# EAGLE schematic dashboard (EAGLE 8.0.1)
CREVISION: V3; DESIGNER: Henrik K. B. Jensen

## Sheet 1 of 3
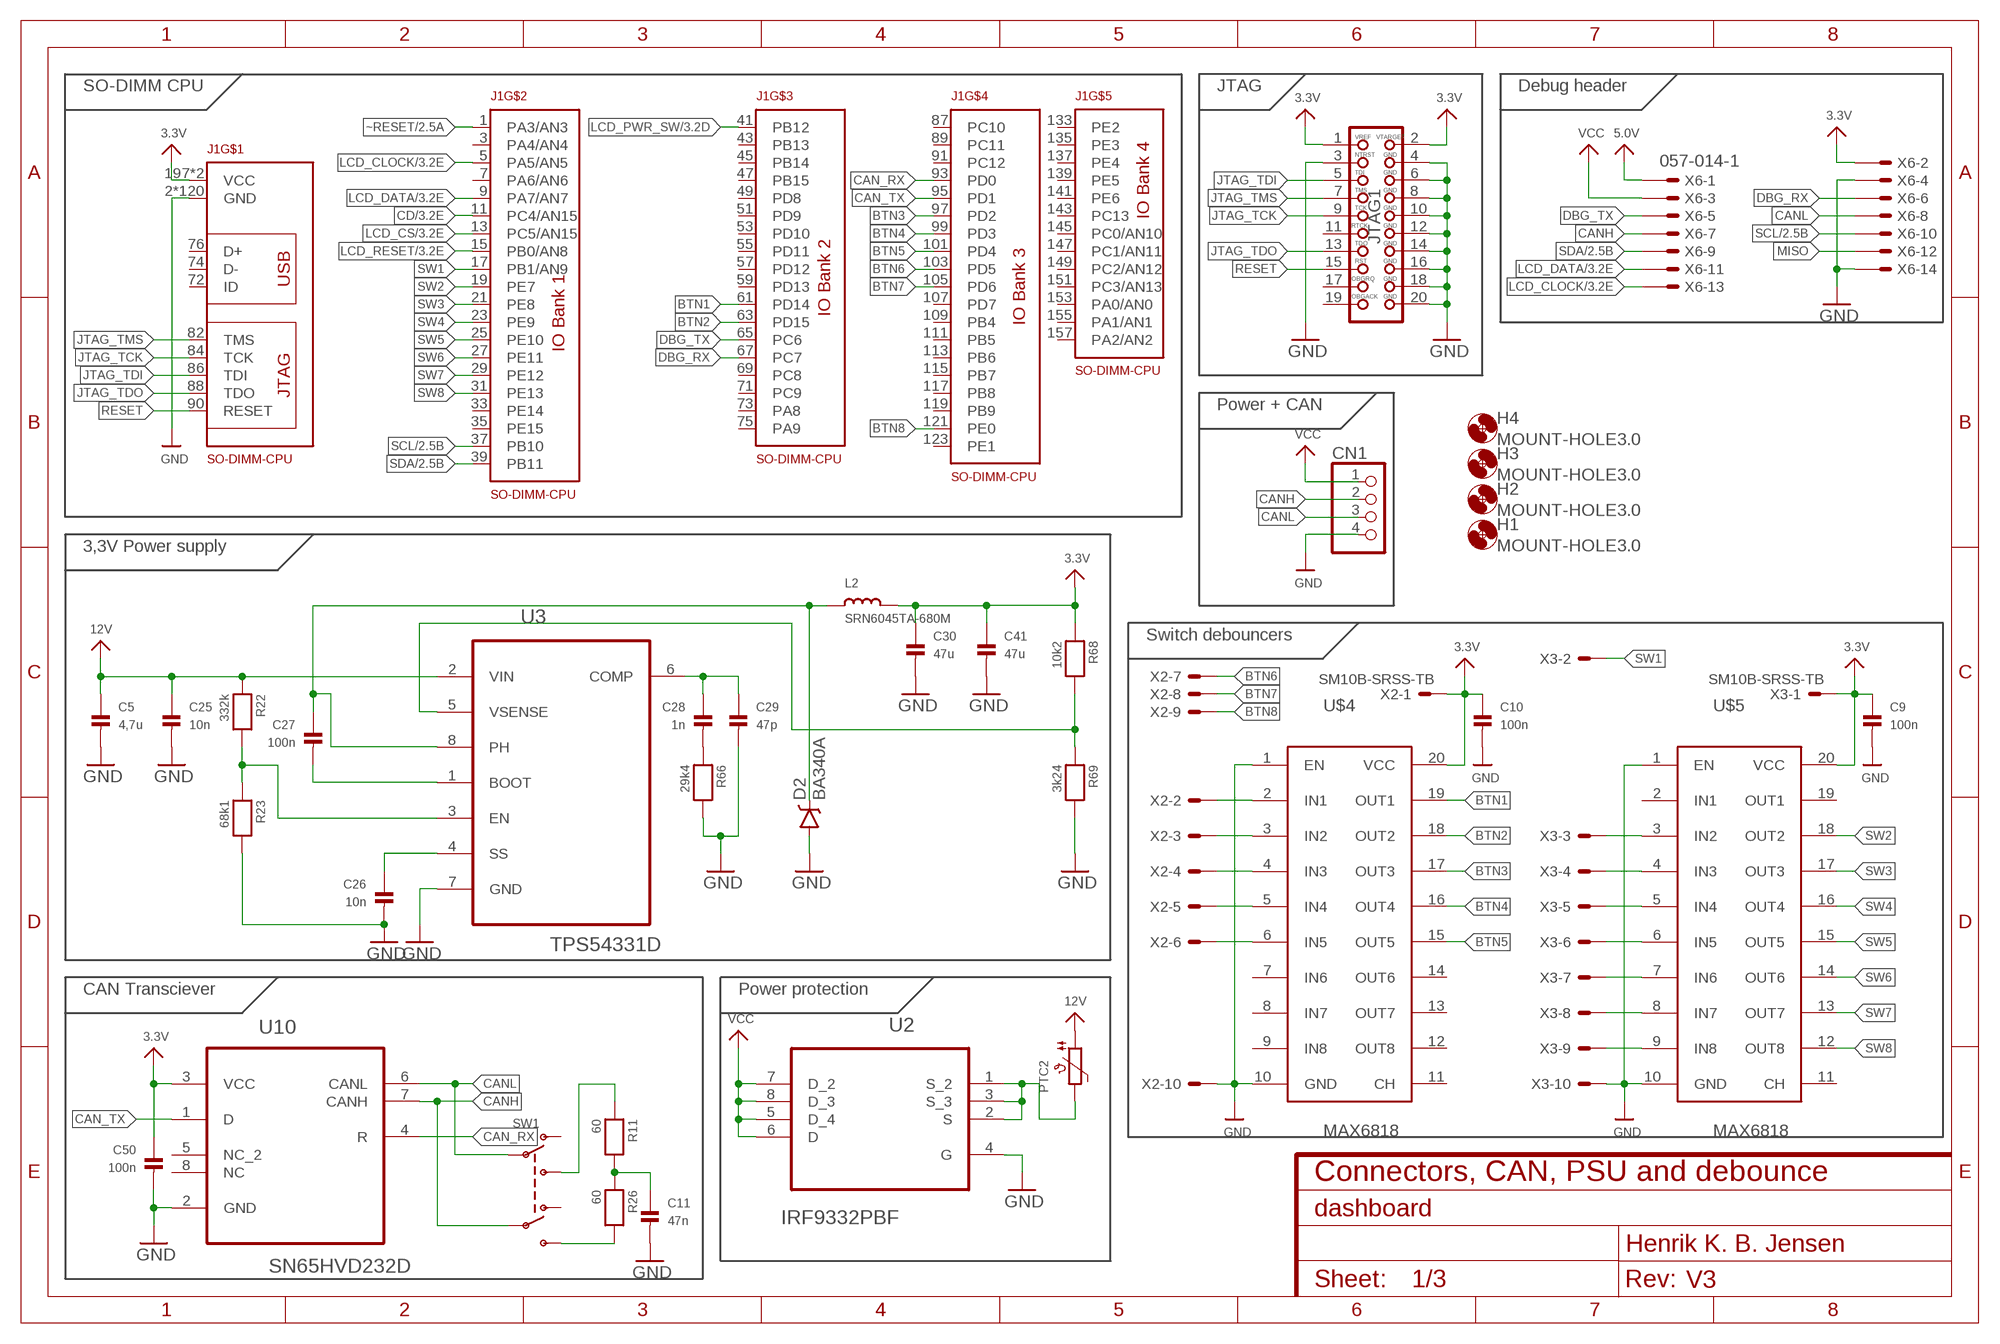
[diagram p0: schematic, sheet 1]

### Parts
C5  4,7u  CAP_CERAMIC_0805  [_0805]
C9  100n  CAP_CERAMIC_0603  [_0603]
C10  100n  CAP_CERAMIC_0603  [_0603]
C11  47n  CAP_CERAMIC_0603  [_0603]
C25  10n  CAP_CERAMIC_0603  [_0603]
C26  10n  CAP_CERAMIC_0603  [_0603]
C27  100n  CAP_CERAMIC_0603  [_0603]
C28  1n  CAP_CERAMIC_0603  [_0603]
C29  47p  CAP_CERAMIC_0603  [_0603]
C30  47u  CAP_CERAMIC_0805  [_0805]
C41  47u  CAP_CERAMIC_0805  [_0805]
C50  100n  CAP_CERAMIC_0603  [_0603]
CN1  JST_4PIN  [JSTPH4]
D2  BA340A  B340A  [SMA-DIODE]
H1  MOUNT-HOLE3.0  [3,0]
H2  MOUNT-HOLE3.0  [3,0]
H3  MOUNT-HOLE3.0  [3,0]
H4  MOUNT-HOLE3.0  [3,0]
J1  SO-DIMM-CPU  [SODIMM-CONNECTOR-2.5V]
JTAG1  JTAG-ARM  [JTAG-ARM]
L2  SRN6045TA-680M  INDUCTORTDK_VLC6045  [INDUCTOR_6X6MM_TDK_VLC6045]
PTC2  PTC1812  [PTC1812]
R11  60  RESISTOR_0603  [_0603]
R22  332k  RESISTOR_0603  [_0603]
R23  68k1  RESISTOR_0603  [_0603]
R26  60  RESISTOR_0603  [_0603]
R66  29k4  RESISTOR_0603  [_0603]
R68  10k2  RESISTOR_0603  [_0603]
R69  3k24  RESISTOR_0603  [_0603]
SW1  SWITCH_DPDT  [DPDT_SMT_JS202011SCQN]
U2  IRF9332PBF  [SOIC127P600X175-8N]
U3  TPS54331D  [SOIC127P600X175-8N]
U10  SN65HVD232D  [SOIC127P600X175-8N]
U$4  MAX6818  [SOP20]
U$5  MAX6818  [SOP20]
X2  SM10B-SRSS-TB  [SM10B-SRSS-TB]
X3  SM10B-SRSS-TB  [SM10B-SRSS-TB]
X6  057-014-1  [057-014-1]

### Nets
3.3V: C9.1 C10.1 C30.1 C41.1 C50.1 J1.197(VCC) J1.199(VCC) JTAG1.1 JTAG1.2 L2.P$2 R68.1 U10.3(VCC) U$4.20(VCC) U$5.20(VCC) X2.1 X3.1 X6.2 ; also sheet 2,3
5.0V: X6.1
12V: C5.1 C25.1 PTC2.P$1 R22.1 U3.2(VIN)
BTN1: J1.61(PD14) U$4.19(OUT1)
BTN2: J1.63(PD15) U$4.18(OUT2)
BTN3: J1.97(PD2) U$4.17(OUT3)
BTN4: J1.99(PD3) U$4.16(OUT4)
BTN5: J1.101(PD4) U$4.15(OUT5)
BTN6: J1.103(PD5) X2.7
BTN7: J1.105(PD6) X2.8
BTN8: J1.121(PE0) X2.9
CAN_RX: J1.93(PD0) U10.4(R)
CAN_TX: J1.95(PD1) U10.1(D)
CANH: CN1.2 SW1.P$5(P2) U10.7(CANH) X6.7
CANL: CN1.3 SW1.P$2(P1) U10.6(CANL) X6.8
CD: J1.11(PC4/AN15) ; also sheet 3
DBG_RX: J1.67(PC7) X6.6
DBG_TX: J1.65(PC6) X6.5
GND: C5.2 C9.2 C10.2 C11.2 C25.2 C26.2 C29.2 C30.2 C41.2 C50.2 CN1.4 D2.A J1.2(GND) J1.4(GND) J1.6(GND) J1.8(GND) J1.10(GND) J1.12(GND) J1.14(GND) J1.16(GND) J1.18(GND) J1.20(GND) J1.22(GND) J1.24(GND) J1.26(GND) J1.28(GND) J1.30(GND) J1.32(GND) J1.34(GND) J1.36(GND) J1.38(GND) J1.40(GND) J1.42(GND) J1.44(GND) J1.46(GND) J1.48(GND) J1.50(GND) J1.52(GND) J1.54(GND) J1.56(GND) J1.58(GND) J1.60(GND) J1.62(GND) J1.64(GND) J1.66(GND) J1.68(GND) J1.70(GND) J1.77(GND) J1.78(GND) J1.79(GND) J1.80(GND) J1.81(GND) J1.83(GND) J1.85(GND) J1.92(GND) J1.94(GND) J1.96(GND) J1.98(GND) J1.100(GND) J1.102(GND) J1.104(GND) J1.106(GND) J1.108(GND) J1.110(GND) J1.112(GND) J1.114(GND) J1.116(GND) J1.118(GND) J1.120(GND) J1.122(GND) J1.124(GND) J1.125(GND) J1.126(GND) J1.127(GND) J1.128(GND) J1.129(GND) J1.130(GND) J1.131(GND) J1.132(GND) J1.134(GND) J1.136(GND) J1.138(GND) J1.140(GND) J1.142(GND) J1.144(GND) J1.146(GND) J1.148(GND) J1.150(GND) J1.152(GND) J1.154(GND) J1.156(GND) J1.158(GND) J1.159(GND) J1.160(GND) J1.161(GND) J1.162(GND) J1.163(GND) J1.164(GND) J1.165(GND) J1.166(GND) J1.167(GND) J1.168(GND) J1.169(GND) J1.170(GND) J1.171(GND) J1.172(GND) J1.173(GND) J1.174(GND) J1.175(GND) J1.176(GND) J1.177(GND) J1.178(GND) J1.179(GND) J1.180(GND) J1.181(GND) J1.182(GND) J1.183(GND) J1.184(GND) J1.185(GND) J1.186(GND) J1.187(GND) J1.188(GND) J1.189(GND) J1.190(GND) J1.191(GND) J1.192(GND) J1.193(GND) J1.194(GND) J1.195(GND) J1.196(GND) J1.198(GND) J1.200(GND) JTAG1.3 JTAG1.4 JTAG1.6 JTAG1.8 JTAG1.10 JTAG1.12 JTAG1.14 JTAG1.16 JTAG1.18 JTAG1.20 R23.2 R66.2 R69.2 U2.4(G) U3.7(GND) U10.2(GND) U$4.1(EN) U$4.10(GND) U$5.1(EN) U$5.10(GND) X2.10 X3.10 X6.4 X6.14 ; also sheet 2,3
JTAG_TCK: J1.84(TCK) JTAG1.9
JTAG_TDI: J1.86(TDI) JTAG1.5
JTAG_TDO: J1.88(TDO) JTAG1.13
JTAG_TMS: J1.82(TMS) JTAG1.7
LCD_CLOCK: J1.5(PA5/AN5) X6.13 ; also sheet 3
LCD_CS: J1.13(PC5/AN15) ; also sheet 3
LCD_DATA: J1.9(PA7/AN7) X6.11 ; also sheet 3
LCD_PWR_SW: J1.41(PB12) ; also sheet 3
LCD_RESET: J1.15(PB0/AN8) ; also sheet 3
MISO: X6.12
N$77: C26.1 U3.4(SS)
N$78: R22.2 R23.1 U3.3(EN)
N$79: C27.2 U3.1(BOOT)
N$80: C27.1 D2.C L2.P$1 U3.8(PH)
N$81: C28.2 R66.1
N$82: C28.1 C29.1 U3.6(COMP)
N$83: R68.2 R69.1 U3.5(VSENSE)
N$84: PTC2.P$2 U2.1(S_2) U2.2(S) U2.3(S_3)
N$85: R26.2 SW1.P$4(S2)
N$86: C11.1 R11.2 R26.1
N$103: U$4.2(IN1) X2.2
N$105: U$5.3(IN2) X3.3
N$106: U$5.4(IN3) X3.4
N$107: U$5.5(IN4) X3.5
N$108: U$5.6(IN5) X3.6
N$109: U$5.7(IN6) X3.7
N$110: U$5.8(IN7) X3.8
N$111: U$5.9(IN8) X3.9
N$112: U$4.3(IN2) X2.3
N$113: U$4.4(IN3) X2.4
N$114: U$4.5(IN4) X2.5
N$115: U$4.6(IN5) X2.6
N$119: R11.1 SW1.P$3(S1)
RESET: J1.90(RESET) JTAG1.15
SCL: J1.37(PB10) X6.10 ; also sheet 2,3
SDA: J1.39(PB11) X6.9 ; also sheet 2,3
SW1: J1.17(PB1/AN9) X3.2
SW2: J1.19(PE7) U$5.18(OUT2)
SW3: J1.21(PE8) U$5.17(OUT3)
SW4: J1.23(PE9) U$5.16(OUT4)
SW5: J1.25(PE10) U$5.15(OUT5)
SW6: J1.27(PE11) U$5.14(OUT6)
SW7: J1.29(PE12) U$5.13(OUT7)
SW8: J1.31(PE13) U$5.12(OUT8)
VCC: CN1.1 U2.5(D_4) U2.6(D) U2.7(D_2) U2.8(D_3) X6.3
~RESET: J1.1(PA3/AN3) ; also sheet 2,3
Unconnected: J1.3(PA4/AN4) J1.7(PA6/AN6) J1.33(PE14) J1.35(PE15) J1.43(PB13) J1.45(PB14) J1.47(PB15) J1.49(PD8) J1.51(PD9) J1.53(PD10) J1.55(PD11) J1.57(PD12) J1.59(PD13) J1.69(PC8) J1.71(PC9) J1.72(ID) J1.73(PA8) J1.74(D-) J1.75(PA9) J1.76(D+) J1.87(PC10) J1.89(PC11) J1.91(PC12) J1.107(PD7) J1.109(PB4) J1.111(PB5) J1.113(PB6) J1.115(PB7) J1.117(PB8) J1.119(PB9) J1.123(PE1) J1.133(PE2) J1.135(PE3) J1.137(PE4) J1.139(PE5) J1.141(PE6) J1.143(PC13) J1.145(PC0/AN10) J1.147(PC1/AN11) J1.149(PC2/AN12) J1.151(PC3/AN13) J1.153(PA0/AN0) J1.155(PA1/AN1) J1.157(PA2/AN2) JTAG1.11 JTAG1.17 JTAG1.19 SW1.P$1(O1) SW1.P$6(O2) U10.5(NC_2) U10.8(NC) U$4.7(IN6) U$4.8(IN7) U$4.9(IN8) U$4.11(CH) U$4.12(OUT8) U$4.13(OUT7) U$4.14(OUT6) U$5.2(IN1) U$5.11(CH) U$5.19(OUT1)

### Notes on the sheet
- SO-DIMM CPU | JTAG | Debug header
- Power + CAN
- 3,3V Power supply
- Switch debouncers
- CAN Transciever | Power protection
- Connectors, CAN, PSU and debounce

## Sheet 2 of 3
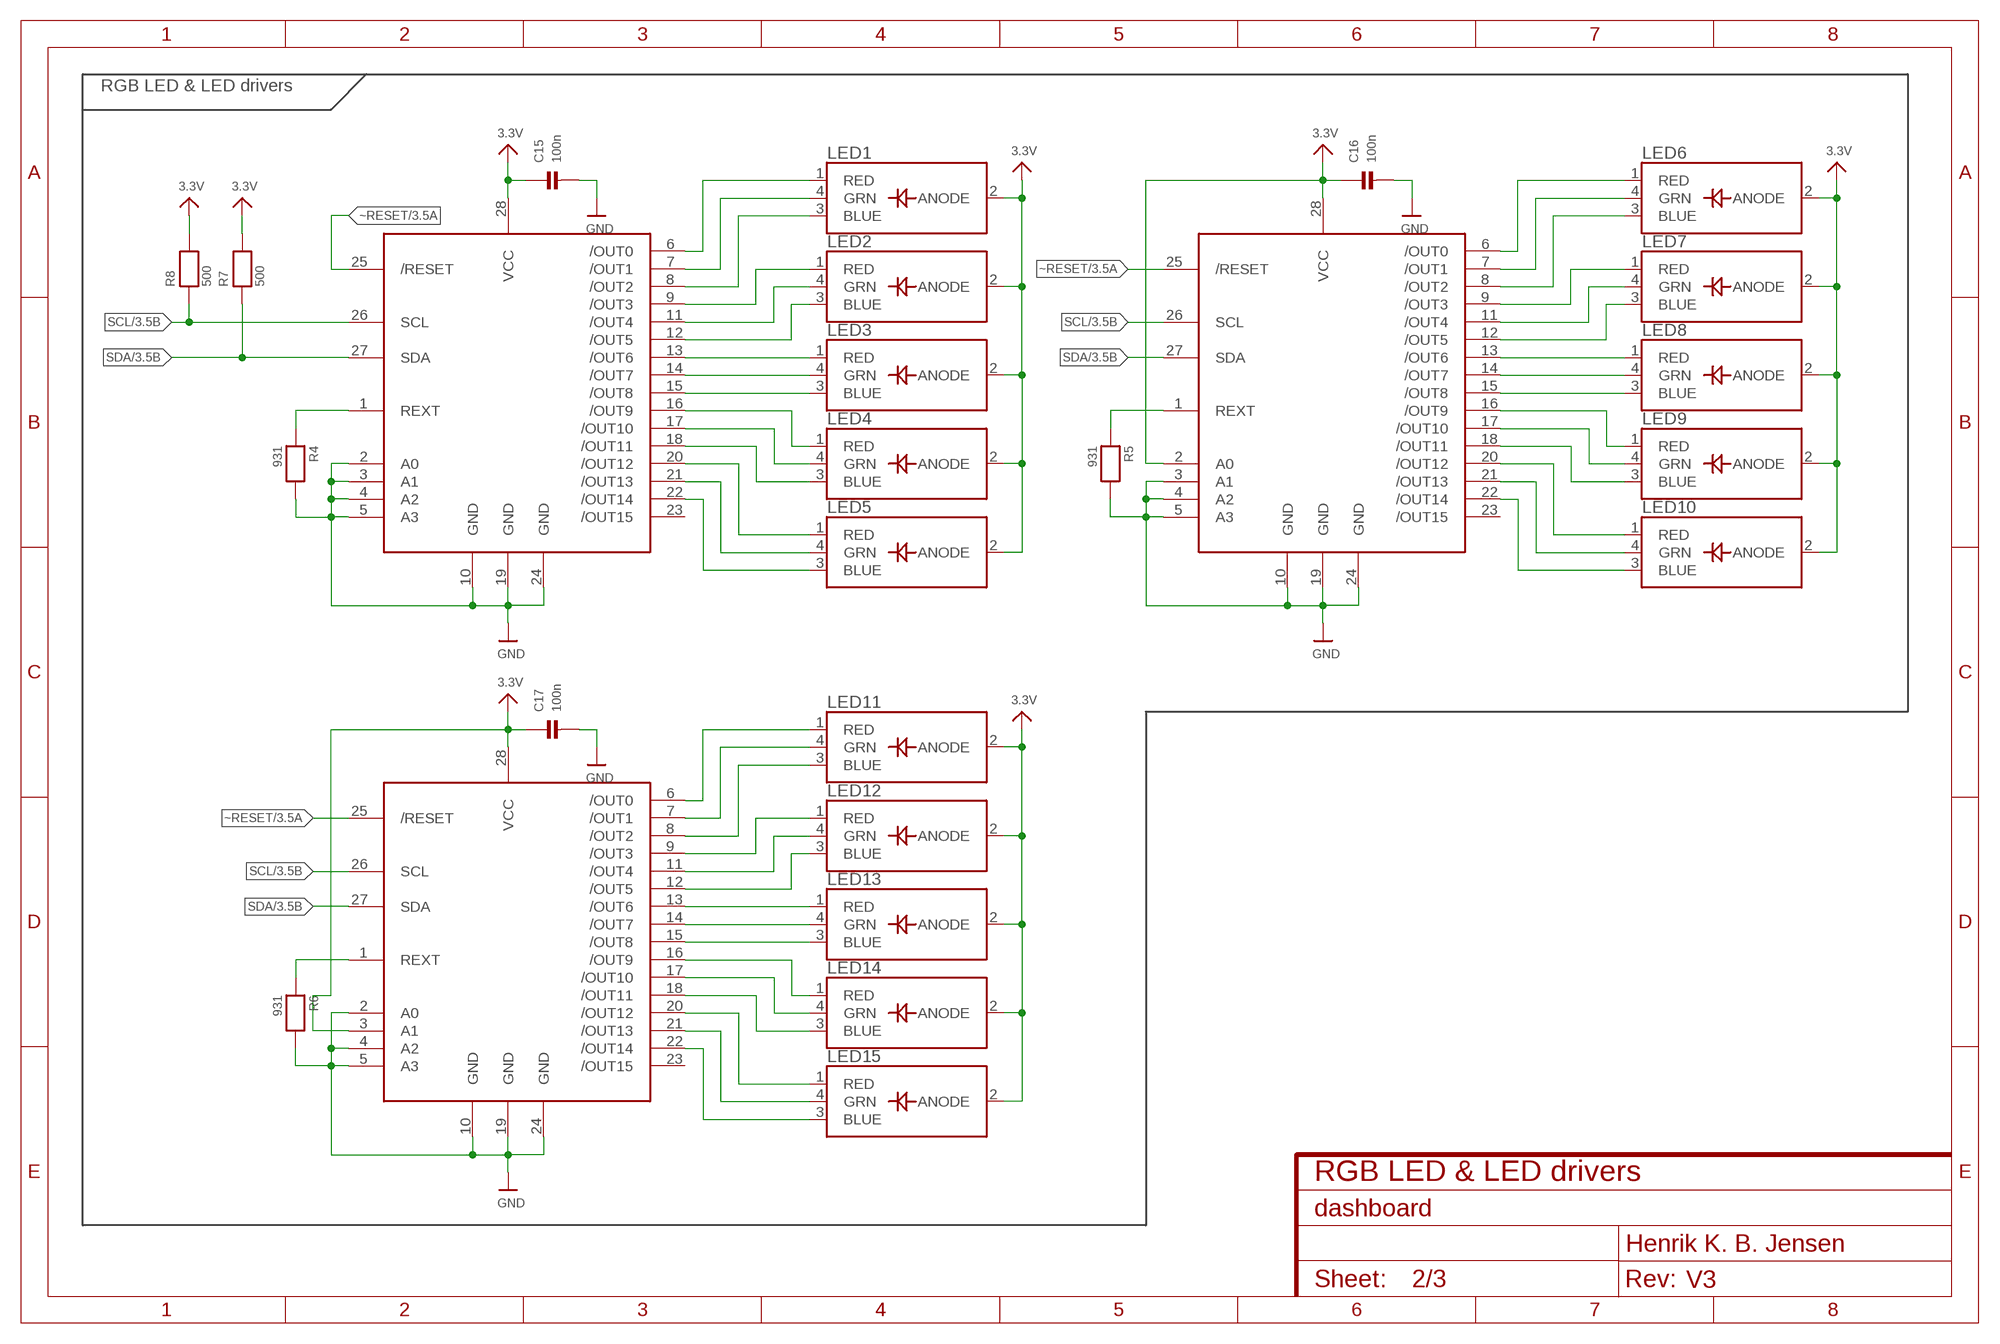
[diagram p1: schematic, sheet 2]

### Parts
C15  100n  CAP_CERAMIC_0603  [_0603]
C16  100n  CAP_CERAMIC_0603  [_0603]
C17  100n  CAP_CERAMIC_0603  [_0603]
LED1  LED_RGB_PLCC4  [RGBLED_PLCC4]
LED2  LED_RGB_PLCC4  [RGBLED_PLCC4]
LED3  LED_RGB_PLCC4  [RGBLED_PLCC4]
LED4  LED_RGB_PLCC4  [RGBLED_PLCC4]
LED5  LED_RGB_PLCC4  [RGBLED_PLCC4]
LED6  LED_RGB_PLCC4  [RGBLED_PLCC4]
LED7  LED_RGB_PLCC4  [RGBLED_PLCC4]
LED8  LED_RGB_PLCC4  [RGBLED_PLCC4]
LED9  LED_RGB_PLCC4  [RGBLED_PLCC4]
LED10  LED_RGB_PLCC4  [RGBLED_PLCC4]
LED11  LED_RGB_PLCC4  [RGBLED_PLCC4]
LED12  LED_RGB_PLCC4  [RGBLED_PLCC4]
LED13  LED_RGB_PLCC4  [RGBLED_PLCC4]
LED14  LED_RGB_PLCC4  [RGBLED_PLCC4]
LED15  LED_RGB_PLCC4  [RGBLED_PLCC4]
R4  931  RESISTOR_0603  [_0603]
R5  931  RESISTOR_0603  [_0603]
R6  931  RESISTOR_0603  [_0603]
R7  500  RESISTOR_0603  [_0603]
R8  500  RESISTOR_0603  [_0603]
U$30  TLC59116  [TSSOP28]
U$33  TLC59116  [TSSOP28]
U$36  TLC59116  [TSSOP28]

### Nets
3.3V: C15.1 C16.1 C17.1 LED1.2(ANODE) LED2.2(ANODE) LED3.2(ANODE) LED4.2(ANODE) LED5.2(ANODE) LED6.2(ANODE) LED7.2(ANODE) LED8.2(ANODE) LED9.2(ANODE) LED10.2(ANODE) LED11.2(ANODE) LED12.2(ANODE) LED13.2(ANODE) LED14.2(ANODE) LED15.2(ANODE) R7.2 R8.2 U$30.28(VCC) U$33.2(A0) U$33.28(VCC) U$36.3(A1) U$36.28(VCC) ; also sheet 1,3
GND: C15.2 C16.2 C17.2 R4.2 R5.2 R6.2 U$30.2(A0) U$30.3(A1) U$30.4(A2) U$30.5(A3) U$30.10(GND) U$30.19(GND) U$30.24(GND) U$33.3(A1) U$33.4(A2) U$33.5(A3) U$33.10(GND) U$33.19(GND) U$33.24(GND) U$36.2(A0) U$36.4(A2) U$36.5(A3) U$36.10(GND) U$36.19(GND) U$36.24(GND) ; also sheet 1,3
N$7: LED1.1(RED) U$30.6(/OUT0)
N$8: LED1.4(GRN) U$30.7(/OUT1)
N$10: LED1.3(BLUE) U$30.8(/OUT2)
N$11: LED2.1(RED) U$30.9(/OUT3)
N$12: LED2.4(GRN) U$30.11(/OUT4)
N$13: LED2.3(BLUE) U$30.12(/OUT5)
N$14: LED3.1(RED) U$30.13(/OUT6)
N$15: LED3.4(GRN) U$30.14(/OUT7)
N$16: LED3.3(BLUE) U$30.15(/OUT8)
N$17: LED4.1(RED) U$30.16(/OUT9)
N$18: LED4.4(GRN) U$30.17(/OUT10)
N$19: LED4.3(BLUE) U$30.18(/OUT11)
N$20: LED5.1(RED) U$30.20(/OUT12)
N$21: LED5.4(GRN) U$30.21(/OUT13)
N$22: LED5.3(BLUE) U$30.22(/OUT14)
N$23: LED6.1(RED) U$33.6(/OUT0)
N$24: LED6.4(GRN) U$33.7(/OUT1)
N$25: LED6.3(BLUE) U$33.8(/OUT2)
N$26: LED7.1(RED) U$33.9(/OUT3)
N$27: LED7.4(GRN) U$33.11(/OUT4)
N$28: LED7.3(BLUE) U$33.12(/OUT5)
N$29: LED8.1(RED) U$33.13(/OUT6)
N$30: LED8.4(GRN) U$33.14(/OUT7)
N$31: LED8.3(BLUE) U$33.15(/OUT8)
N$32: LED9.1(RED) U$33.16(/OUT9)
N$33: LED9.4(GRN) U$33.17(/OUT10)
N$34: LED9.3(BLUE) U$33.18(/OUT11)
N$35: LED10.1(RED) U$33.20(/OUT12)
N$36: LED10.4(GRN) U$33.21(/OUT13)
N$37: LED10.3(BLUE) U$33.22(/OUT14)
N$38: LED11.1(RED) U$36.6(/OUT0)
N$39: LED11.4(GRN) U$36.7(/OUT1)
N$40: LED11.3(BLUE) U$36.8(/OUT2)
N$41: LED12.1(RED) U$36.9(/OUT3)
N$42: LED12.4(GRN) U$36.11(/OUT4)
N$43: LED12.3(BLUE) U$36.12(/OUT5)
N$44: LED13.1(RED) U$36.13(/OUT6)
N$45: LED13.4(GRN) U$36.14(/OUT7)
N$46: LED13.3(BLUE) U$36.15(/OUT8)
N$47: LED14.1(RED) U$36.16(/OUT9)
N$48: LED14.4(GRN) U$36.17(/OUT10)
N$49: LED14.3(BLUE) U$36.18(/OUT11)
N$50: LED15.1(RED) U$36.20(/OUT12)
N$51: LED15.4(GRN) U$36.21(/OUT13)
N$52: LED15.3(BLUE) U$36.22(/OUT14)
N$53: R4.1 U$30.1(REXT)
N$55: R5.1 U$33.1(REXT)
N$56: R6.1 U$36.1(REXT)
SCL: R8.1 U$30.26(SCL) U$33.26(SCL) U$36.26(SCL) ; also sheet 1,3
SDA: R7.1 U$30.27(SDA) U$33.27(SDA) U$36.27(SDA) ; also sheet 1,3
~RESET: U$30.25(/RESET) U$33.25(/RESET) U$36.25(/RESET) ; also sheet 1,3
Unconnected: U$30.23(/OUT15) U$33.23(/OUT15) U$36.23(/OUT15)

### Notes on the sheet
- RGB LED & LED drivers
- RGB LED & LED drivers

## Sheet 3 of 3
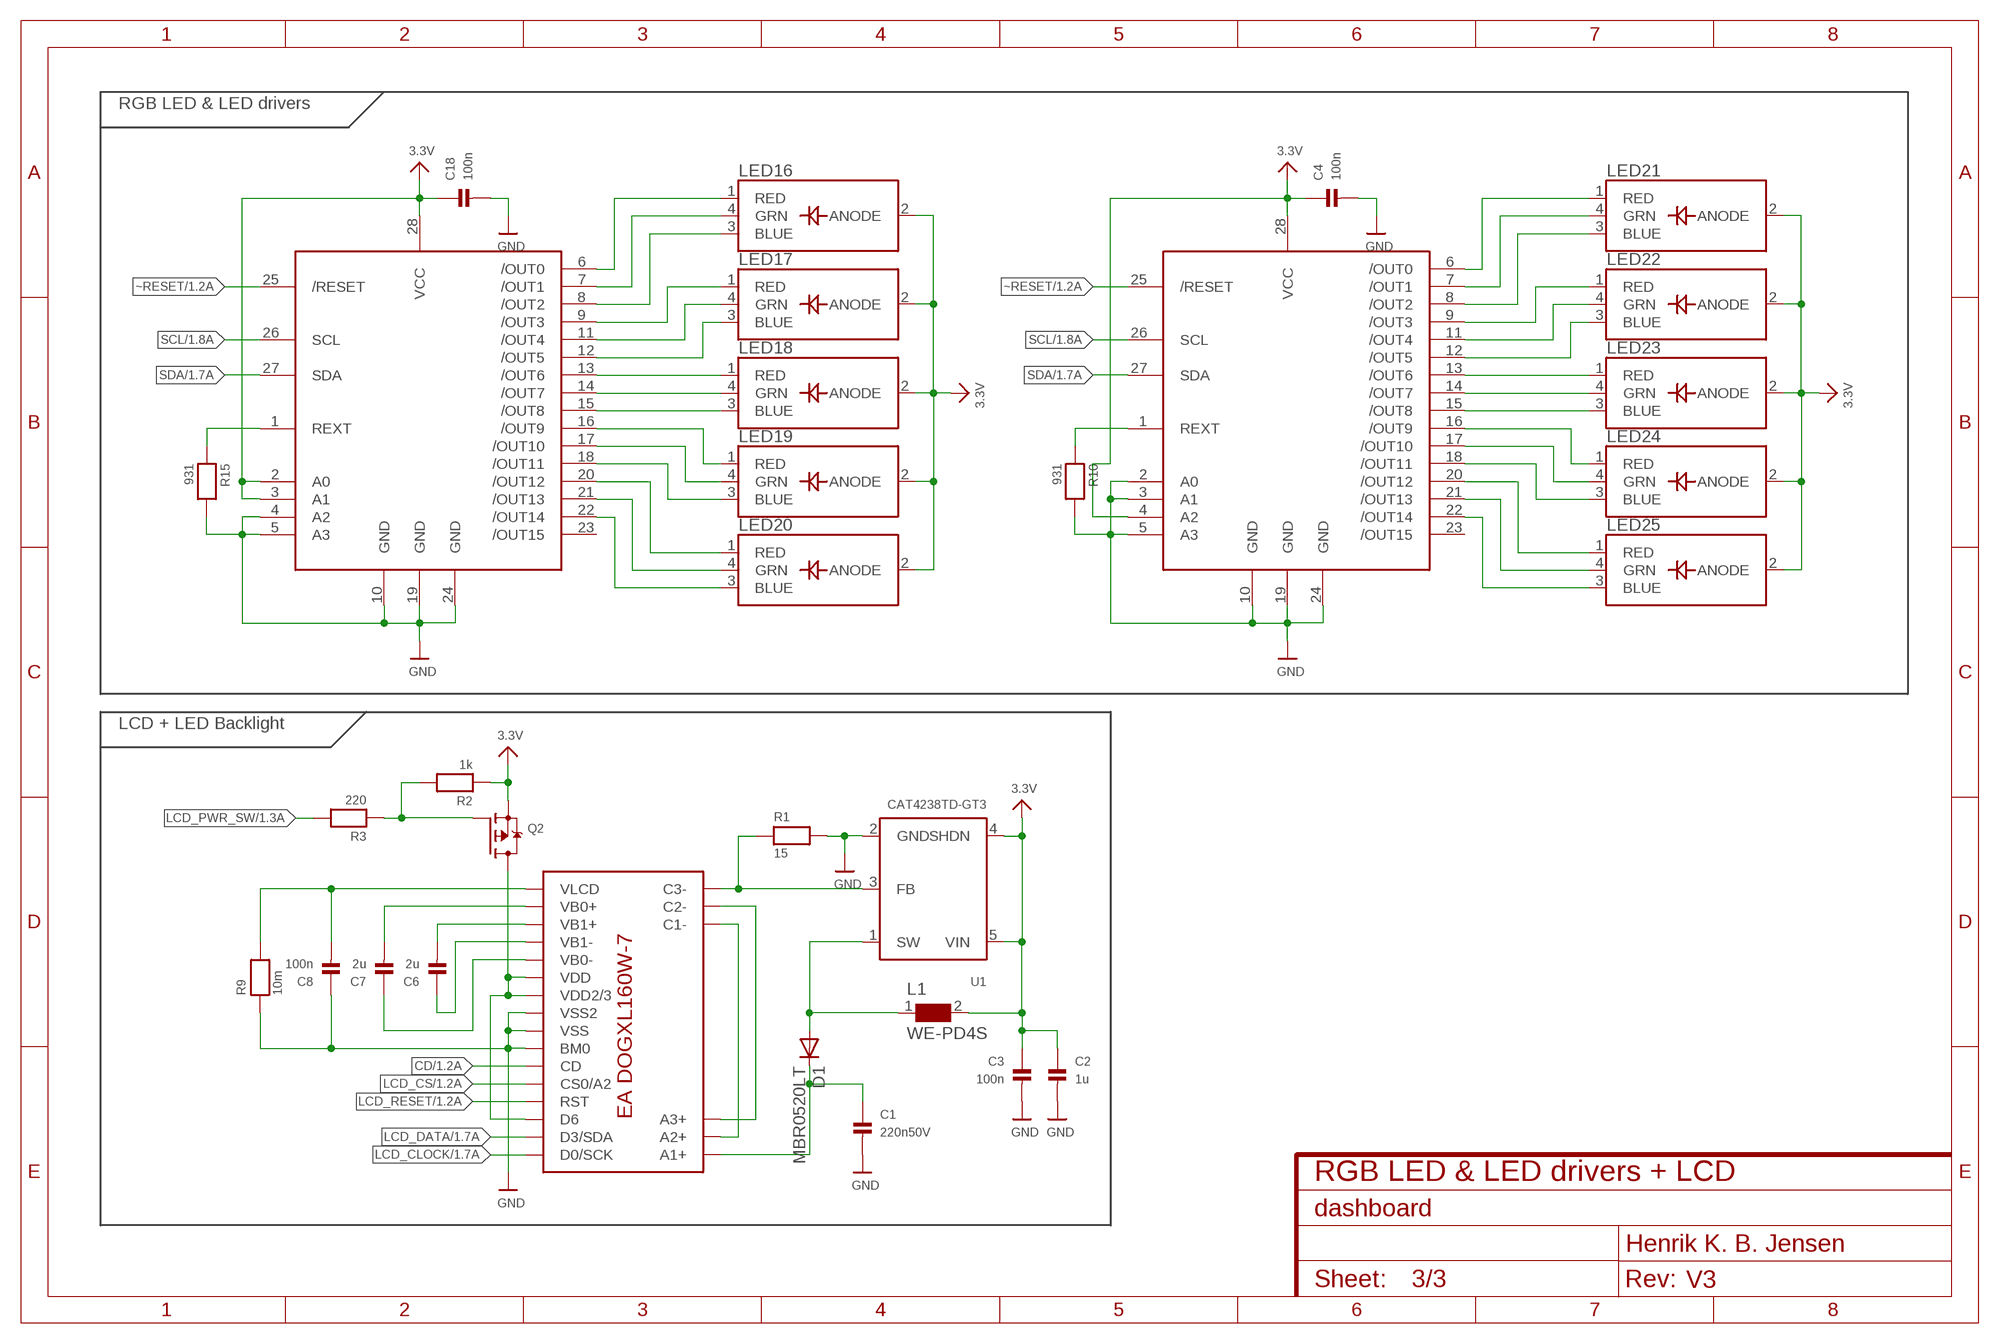
[diagram p2: schematic, sheet 3]

### Parts
C1  220n50V  CAP_CERAMIC_0805  [_0805]
C2  1u  CAP_CERAMIC_0805  [_0805]
C3  100n  CAP_CERAMIC_0603  [_0603]
C4  100n  CAP_CERAMIC_0603  [_0603]
C6  2u  CAP_CERAMIC_0805  [_0805]
C7  2u  CAP_CERAMIC_0805  [_0805]
C8  100n  CAP_CERAMIC_0603  [_0603]
C18  100n  CAP_CERAMIC_0603  [_0603]
D1  MBR0520LT  [SOD123]
L1  WE-PD4S  WE-PD4-7445501_S  [S]
LED16  LED_RGB_PLCC4  [RGBLED_PLCC4]
LED17  LED_RGB_PLCC4  [RGBLED_PLCC4]
LED18  LED_RGB_PLCC4  [RGBLED_PLCC4]
LED19  LED_RGB_PLCC4  [RGBLED_PLCC4]
LED20  LED_RGB_PLCC4  [RGBLED_PLCC4]
LED21  LED_RGB_PLCC4  [RGBLED_PLCC4]
LED22  LED_RGB_PLCC4  [RGBLED_PLCC4]
LED23  LED_RGB_PLCC4  [RGBLED_PLCC4]
LED24  LED_RGB_PLCC4  [RGBLED_PLCC4]
LED25  LED_RGB_PLCC4  [RGBLED_PLCC4]
Q2  MOSFET-PWIDE  [SOT23-WIDE]
R1  15  RESISTOR_0603  [_0603]
R2  1k  RESISTOR_0603  [_0603]
R3  220  RESISTOR_0603  [_0603]
R9  10m  RESISTOR_0805  [_0805]
R10  931  RESISTOR_0603  [_0603]
R15  931  RESISTOR_0603  [_0603]
U1  CAT4238TD-GT3  FAN5331  [SOT23-5]
U$8  TLC59116  [TSSOP28]
U$10  EA-DOGXL160W-7  [EA-DOGXL160W-7]
U$51  TLC59116  [TSSOP28]

### Nets
3.3V: C2.1 C3.1 C4.1 C18.1 L1.2 LED16.2(ANODE) LED17.2(ANODE) LED18.2(ANODE) LED19.2(ANODE) LED20.2(ANODE) LED21.2(ANODE) LED22.2(ANODE) LED23.2(ANODE) LED24.2(ANODE) LED25.2(ANODE) Q2.2(S) R2.1 U1.4(SHDN) U1.5(VIN) U$8.4(A2) U$8.28(VCC) U$51.2(A0) U$51.3(A1) U$51.28(VCC) ; also sheet 1,2
CD: U$10.P$27(CD) ; also sheet 1
GND: C1.2 C2.2 C3.2 C4.2 C8.1 C18.2 R1.2 R9.1 R10.2 R15.2 U1.2(GND) U$8.2(A0) U$8.3(A1) U$8.5(A3) U$8.10(GND) U$8.19(GND) U$8.24(GND) U$10.P$24(VSS2) U$10.P$25(VSS) U$10.P$26(BM0) U$51.4(A2) U$51.5(A3) U$51.10(GND) U$51.19(GND) U$51.24(GND) ; also sheet 1,2
LCD_CLOCK: U$10.P$32(D0/SCK) ; also sheet 1
LCD_CS: U$10.P$28(CS0/A2) ; also sheet 1
LCD_DATA: U$10.P$31(D3/SDA) ; also sheet 1
LCD_PWR_SW: R3.2 ; also sheet 1
LCD_RESET: U$10.P$29(RST) ; also sheet 1
N$1: U$10.P$2(A2+) U$10.P$14(C1-)
N$2: U$10.P$3(A3+) U$10.P$15(C2-)
N$3: R1.1 U1.3(FB) U$10.P$16(C3-)
N$4: C1.1 D1.C U$10.P$1(A1+)
N$5: D1.A L1.1 U1.1(SW)
N$6: Q2.3(D) U$10.P$22(VDD) U$10.P$23(VDD2/3) U$10.P$30(D6)
N$9: Q2.1(G) R2.2 R3.1
N$54: LED16.1(RED) U$51.6(/OUT0)
N$57: C6.1 U$10.P$20(VB1-)
N$58: C7.1 U$10.P$21(VB0-)
N$59: C6.2 U$10.P$19(VB1+)
N$60: C7.2 U$10.P$18(VB0+)
N$61: C8.2 R9.2 U$10.P$17(VLCD)
N$62: LED16.4(GRN) U$51.7(/OUT1)
N$63: LED16.3(BLUE) U$51.8(/OUT2)
N$64: LED17.1(RED) U$51.9(/OUT3)
N$65: LED17.4(GRN) U$51.11(/OUT4)
N$66: LED17.3(BLUE) U$51.12(/OUT5)
N$67: LED18.1(RED) U$51.13(/OUT6)
N$68: LED18.4(GRN) U$51.14(/OUT7)
N$69: LED18.3(BLUE) U$51.15(/OUT8)
N$70: LED19.1(RED) U$51.16(/OUT9)
N$71: LED19.4(GRN) U$51.17(/OUT10)
N$72: LED19.3(BLUE) U$51.18(/OUT11)
N$73: LED20.1(RED) U$51.20(/OUT12)
N$74: LED20.4(GRN) U$51.21(/OUT13)
N$75: LED20.3(BLUE) U$51.22(/OUT14)
N$76: R15.1 U$51.1(REXT)
N$87: LED21.1(RED) U$8.6(/OUT0)
N$88: LED21.4(GRN) U$8.7(/OUT1)
N$89: LED21.3(BLUE) U$8.8(/OUT2)
N$90: LED22.1(RED) U$8.9(/OUT3)
N$91: LED22.4(GRN) U$8.11(/OUT4)
N$92: LED22.3(BLUE) U$8.12(/OUT5)
N$93: LED23.1(RED) U$8.13(/OUT6)
N$94: LED23.4(GRN) U$8.14(/OUT7)
N$95: LED23.3(BLUE) U$8.15(/OUT8)
N$96: LED24.1(RED) U$8.16(/OUT9)
N$97: LED24.4(GRN) U$8.17(/OUT10)
N$98: LED24.3(BLUE) U$8.18(/OUT11)
N$99: LED25.1(RED) U$8.20(/OUT12)
N$100: LED25.4(GRN) U$8.21(/OUT13)
N$101: LED25.3(BLUE) U$8.22(/OUT14)
N$102: R10.1 U$8.1(REXT)
SCL: U$8.26(SCL) U$51.26(SCL) ; also sheet 1,2
SDA: U$8.27(SDA) U$51.27(SDA) ; also sheet 1,2
~RESET: U$8.25(/RESET) U$51.25(/RESET) ; also sheet 1,2
Unconnected: U$8.23(/OUT15) U$51.23(/OUT15)

### Notes on the sheet
- RGB LED & LED drivers
- LCD + LED Backlight
- RGB LED & LED drivers + LCD

## Library data of the parts
C1-C11 C15-C18 C25-C30 C41 C50 = microbuilder:CAP_CERAMIC: Ceramic Capacitors 0402 - 0402 Surface Mount Capacitors 16pF 50V 5% [Digikey: 445-4899-2-ND] 18pF 50V 5% [Digikey: 490-1281-2-ND] 22pF 50V 5% [Digikey: 490-1283-2-ND] 68pF 50V 5% [Digikey: 490-1289-2-ND] 0.1uF 10V 10% [Digikey: 490-1318-2-ND] 1.0uF 6.3V 10% [Digikey: 490-1320-2-ND] 0603 - 0603 Surface Mount Capacitors 16 pF 50V 5% [Digikey: 445-5051-2-ND] 22 pF 50V [Digikey: PCC220ACVTR-ND] 33 pF 50V 5% [Digikey: 490-1415-1-ND] 56pF 50V 5% [Digikey: 490-1421-1-ND] 220pF 50V 5% [Digikey: 445-1285-1-ND] 680 pF 50V 2200 pF 50V 5% C0G [Digikey: 445-1297-1-ND] 5600 pF 100V 5% X7R [Digikey: 478-3711-1-ND] 0.1 µF 25V 10% [Digikey: PCC2277TR-ND] 0.22 µF 16V 10% X7R [Digikey: 445-1318-1-ND] 1.0 µF 25V 10% [Digikey: 445-5146-2-ND] 0603 - RF Specific 3pF 250V +/-0.1pF RF [Digikey: 712-1347-1-ND] 18 pF 250V 5% [Digikey: 478-3505-1-ND or 712-1322-1-ND] 56 pF 250V 5% C0G RF [Digikey: 490-4867-1-ND] 68 pF 250V RF [Digikey: 490-4868-1-ND] 0805 - 0805 Surface Mount Capacitors 220 pF 250V 2% RF Ceramic Capacitor [Digikey: 712-1398-1-ND] 1000 pF 50V 2% NP0 Ceramic Capacitor [Digikey: 478-3760-1-ND] 0.1 µF 25V 10% Ceramic Capacitor [Digikey: PCC1828TR-ND] 1.0 µF 16V 10% Ceramic Capacitor[Digikey: 490-1691-2-ND] 10.0 µF 10V 10% Ceramic Capacitor[Digikey: 709-1228-1-ND] 10.0 uF 16V 10% Ceramic Capacitor [Digikey: 478-5165-2-ND] 47 uF 6.3V 20% Ceramic Capacitor [Digikey: 587-1779-1-ND or 399-5506-1-ND] 1206 - 1206 Surface Mount Capacitors 47uF 10V 20% Ceramic Capacitor [Digikey: 490-5528-1-ND or 399-5508-1-ND or 445-6010-1-ND] 100uF 6.3V -20%, +80% Y5V Ceramic Capacitor (Digikey: 490-4512-1-ND, Mouser: 81-GRM31CF50J107ZE1L)
CN1 = microbuilder:JST_4PIN: JST 4-Pin Right-Angle Connector 4UConnector: 17312
D1 = diode:MBR0520LT: SCHOTTKY BARRIER RECTIFIER Source: http://onsemi.com .. MBR0520LT1-D.pdf
D2 = SparkFun-DiscreteSemi:B340A: Schottky Diode 3A-40V; PROD_ID: DIO-09886
H1-H4 = holes:MOUNT-HOLE: MOUNTING HOLE with drill center marker
J1 = AAU-Racing:SO-DIMM-CPU
JTAG1 = microbuilder:JTAG-ARM: 20 Pin JTAG Connector For use with ARM7, and ARM9. Supported by some Cortex M3 boards with SWJ-DP interfaces (dual SWP/JTAG support). 4UConnector: 03556
L1 = WE-PD4:WE-PD4: SMD-Power Inductors WE-PD4 - Current loading up to 35 A - Compact size - Low-loss ferrite core - High storage capacity - Industry standardized size - Application frequency range up to 10 MHz -- Is recommended for the application with switching regulators from National Semiconductor, Linear Technology, Texas Instruments and Fairchild Semiconductor -- Noise suppression -- Perfectly suitable for switching regulators with extremely high efficiency; MPN: 7445501; OC_FARNELL: 1636112; OC_NEWARK: 08P2667; PACKAGE: Type S; SUPPLIER: Wuerth Elektronik
L2 = microbuilder:INDUCTOR: Inductors 0603: 10nH Ceramic Inductor - microwire antenna/RF (Digikey: 712-1434-2-ND) 0805: 560nH Ceramic Inductor - RF (Digikey: 553-1047-1-ND) 270nH Ceramic Inductor - Q = 40@250MHz, +-5%, 1 Ohm DC Resistance (Digikey: 535-10506-2-ND) 1007 (2518 Metric) SMT: 10µH 10% 250mOhm 820mA 1007 Inductor (Digikey: 587-2189-1-ND) 22µH 10% 500mOhm 580mA 1007 Inductor (Digikey: 587-2190-1-ND) 47µH 10% 950mOhm 420mA 1007 Inductor (Digikey: 587-2191-1-ND) 47µH 5% 100mOhm 1A 1008 Inductor (Digikey: 732-1816-1-ND) 5.0x5.0mm (Taiyo Yuden NR5040 Series) 6.8µH 20% 2.3A 64mOhm Inductor (Digikey: 587-2374-2-ND) 5.0x5.0mm (TDK VLC5045 Series) 4.7µH 20% 3.3A 34mOhm Inductor (Digikey: 445-6526-1-ND) 6.8µH 20% 2.7A 46mOhm Inductor (Digikey: 445-6527-1-ND) 6.0x6.0mm (TDK VLC6045 Series) 4.7µH 20% 3.8A 27mOhm Inductor (Digikey: 445-6538-2-ND) 6.8µH 20% 3A 41mOhm Inductor (Digikey: 445-6540-1-ND) 6.2µH 30% 2.2A 45mOhm Inductor (Digikey: SRR5028-6R2YCT-ND) - Not TDK VLC6045 but footprint should match 6.0x6.0mm (TDK SLF6045 Series) 6.8uH 30% 2A 33mOhm Inductor (Digikey: 445-4572-1-ND, Mouser: 810-SLF645T6R8N2R0PF)
LED1-LED25 = microbuilder:LED_RGB_PLCC4: RGB LED - PLCC4 Cree 20mA Common Anode Digikey: CLV1A-FKB-CJ1M1F1BB7R4S3CT-ND Red: 2.6V Vf, 550mcd Green: 3.2V Vf, 850mcd Blue: 3.2V Vf, 320mcd
PTC2 = microbuilder:PTC: PTC (Resettable Fuse) 1206 Package 250mA PTC (16V Max, Time-to-Trip: 0.08s) - Digikey: F2110CT-ND 1210 Package 100mA PTC (30V Max, Time-to-Trip: 0.6s) - Digikey: MF-USMF010-2CT-ND 1812 Package 750mA PTC (24V Max, Time-to-Trip: 0.2s) - Digikey: MF-MSMF075/24-2CT-ND
Q2 = microbuilder:MOSFET-P: P-Channel Mosfet LEGEND VDS: Voltage Drain-Source ID: Drain Current RDS(ON): Drain-Source On-State Resistance VGS(TH): Gate-Source Threshold Voltage CISS: Drain-Source Input Capacitance SOT-23 Name VDS ID RDS(ON) VGS(TH) CISS Order Number IRLML5103 30V 760mA 600 mOhm -- 75pF @ 25V Digikey: IRLML5103PBFCT-ND IRLML6401 12V 4.3A 50 mOhm 950mV @ 250µA 830pF @ 10V Digikey: IRLML6401PBFTR-ND NTR0202PL 20V 400mA 800 mOhm 2.3V @ 250uA 70pF @ 5V Digikey: NTR0202PLT1GOSTR-ND NTR4101PT1G 20V 1.8A 85 mOhm 1.2V @ 250uA 675pF @ 10V Digikey: NTR4101PT1GOSCT-ND DMP2004K 20V 600mA 900 mOhm 1V @ 250uA 175pF @ 16V Digikey: DMP2004KDICT-ND PMV65XP 20V 3.9A 76 mOhm 950mV @ 1mA 725pF @ 20V Digikey: 568-2358-2-ND TO-252 Name VDS ID RDS(ON) VGS(TH) CISS Order Number AOD417 30V 25A 34 mOhm 3V @ 250µA 920pF @ 15V Digikey: 785-1106-2-ND
R1-R11 R15 R22 R23 R26 R66 R68 R69 = microbuilder:RESISTOR: Resistors 0402 - 0402 Surface Mount Package 22 Ohm 1% 1/16W [Digikey: 311-22.0LRTR-ND] 33 Ohm 5% 1/16W 1.0K 5% 1/16W 1.5K 5% 1/16W 2.0K 1% 1/16W 10.0K 1% 1/16W [Digikey: 311-10.0KLRTR-ND] 10.0K 5% 1/16W [Digikey: RMCF0402JT10K0TR-ND] 12.1K 1% 1/16W [Digikey: 311-22.0LRTR-ND] 100.0K 5% 1/16W 0603 - 0603 Surface Mount Package 0 Ohm 1/10 Watt 1% Resistor 15 Ohm 1/10 Watt 1% Resistor 33 Ohm 1/10 Watt 1% Resistor 49.9 Ohm 1/10 Watt 1% Resistor 100 Ohm 1/10 Watt 1% Resistor 150 Ohm 1/10 Watt 1% Resistor 240 Ohm 1/10 Watt 1% Resistor 390 Ohm 1/10 Watt 1% Resistor 560 Ohm 1/10 Watt 1% Resistor 680 Ohm 1/10 Watt 1% Resistor 750 Ohm 1/10 Watt 1% Resistor 1.0K Ohm 1/10 Watt 1% Resistor 1.5K Ohm 1/10 Watt 1% Resistor 2.0K Ohm 1/10 Watt 1% Resistor 2.2K Ohm 1/10 Watt 1% Resistor 3.3K Ohm 1/10 Watt 1% Resistor 4.7K Ohm 1/10 Watt 1% Resistor 10.0K Ohm 1/10 Watt 1% Resistor 12.0K Ohm 1/10 Watt 1% Resistor 12.1K Ohm 1/10 Watt 1% Resistor 20.0K Ohm 1/10 Watt 1% Resistor 33.0K Ohm 1/10 Watt 1% Resistor 100.0K Ohm 1/10 Watt 1% Resistor 0805 - 0805 Surface Mount Package 0 Ohm 1/8 Watt 1% Resistor 33 Ohm 1/8 Watt 1% Resistor 100 Ohm 1/8 Watt 1% Resistor 150 Ohm 1/8 Watt 1% Resistor 200 Ohm 1/8 Watt 1% Resistor 240 Ohm 1/8 Watt 1% Resistor 330 Ohm 1/8 Watt 1% Resistor 390 Ohm 1/8 Watt 1% Resistor 470 Ohm 1/8 Watt 1% Resistor 1.0K Ohm 1/8 Watt 1% Resistor 1.5K Ohm 1/8 Watt 1% Resistor 2.0K Ohm 1/8 Watt 1% Resistor 4.7K Ohm 1/8 Watt 1% Resistor 5.1K Ohm 1/8 Watt 1% Resistor 5.6K Ohm 1/8 Watt 1% Resistor 10.0K Ohm 1/8 Watt 1% Resistor 22.0K Ohm 1/8 Watt 1% Resistor 33.0K Ohm 1/8 Watt 1% Resistor 100K Ohm 1/8 Watt 1% Resistor 1206 - 1206 Surface Mount Package 2012 - 2010 Surface Mount Package 0.11 Ohm 1/2 Watt 1% Resistor - Digikey: RHM.11UCT-ND
SW1 = microbuilder:SWITCH_DPDT: Switch - DPDT A DPDT Switch acts like an SPDT switch, but has a pair of switches instead of just one. Vertical - 0.3A @ 6V SMT - Digikey: JS202011SCQN
U1 = microbuilder:FAN5331: FAN5331 - LED/OLED 20V Boost Converter Digikey: FAN5331SXCT-ND
U2 = International_Rectifier_By_element14_Batch_1:IRF9332PBF: HEXFET Power MOSFET; MPN: IRF9332PBF; OC_FARNELL: 1857354; OC_NEWARK: 12T9892; PACKAGE: SOIC-8; SUPPLIER: INTERNATIONAL RECTIFIER
U3 = Texas Instruments_By_element14_Batch_1:TPS54331D: 3A, 28V INPUT, STEP DOWN SWIFT? DC/DC CONVERTER WITH ECO-MODE?; MPN: TPS54331D; OC_FARNELL: 1645383; OC_NEWARK: 03P1641; PACKAGE: SOIC-8; SUPPLIER: TI
U10 = Texas Instruments_By_element14_Batch_1:SN65HVD232D: 3.3-V CAN TRANSCEIVERS; MPN: SN65HVD232D; OC_FARNELL: 1103107; OC_NEWARK: 35K4890; PACKAGE: SOIC-8; SUPPLIER: Texas Instruments
U$4 U$5 = Max68x:MAX6818
U$8 U$30 U$33 U$36 U$51 = tlc:TLC59116
U$10 = unicorn_v2:EA-DOGXL160W-7
X2 X3 = con-jst2:?M10B-SRSS-TB: Disconnectable Crimp style connector, 1.0mm pitch 10 contacts
X6 = con-panduit:057-014-: CONNECTOR 10-pin series 057 contact pc board low profile headers